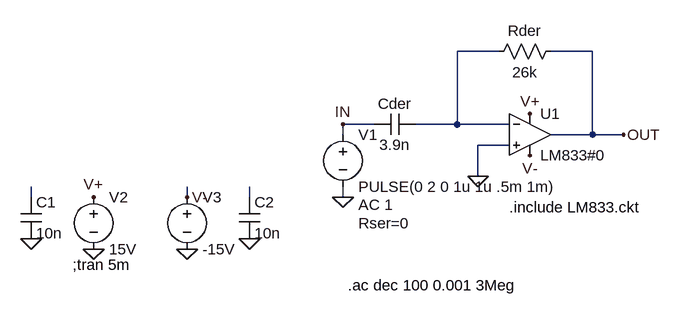
[diagram p0: schematic Derivador no compensado.asc]
Derivador no compensado.asc, the LTspice schematic file:
Version 4
SHEET 1 880 680
WIRE 208 64 144 64
WIRE 352 64 288 64
WIRE 16 176 -32 176
WIRE 144 176 144 64
WIRE 144 176 80 176
WIRE 224 176 144 176
WIRE -32 192 -32 176
WIRE 352 192 352 64
WIRE 352 192 288 192
WIRE 400 192 352 192
WIRE 224 208 176 208
WIRE 176 256 176 208
WIRE -512 288 -512 272
WIRE -272 288 -272 272
WIRE -176 288 -176 272
WIRE -32 288 -32 272
FLAG 176 256 0
FLAG -32 288 0
FLAG -272 368 0
FLAG -416 368 0
FLAG -416 288 V+
FLAG 256 160 V+
FLAG -272 288 V-
FLAG 256 224 V-
FLAG -512 352 0
FLAG -176 352 0
FLAG 400 192 OUT
FLAG -32 176 IN
SYMBOL Opamps\\opamp2 256 128 R0
SYMATTR InstName U1
SYMATTR Value LM833#0
SYMBOL cap 80 160 R90
WINDOW 0 0 32 VBottom 2
WINDOW 3 32 32 VTop 2
SYMATTR InstName Cder
SYMATTR Value 3.9n
SYMBOL voltage -32 176 R0
WINDOW 123 24 124 Left 2
WINDOW 39 24 152 Left 2
SYMATTR Value2 AC 1
SYMATTR SpiceLine Rser=0
SYMATTR InstName V1
SYMATTR Value PULSE(0 2 0 1u 1u .5m 1m)
SYMBOL res 304 48 R90
WINDOW 0 0 56 VBottom 2
WINDOW 3 32 56 VTop 2
SYMATTR InstName Rder
SYMATTR Value 26k
SYMBOL voltage -416 272 R0
WINDOW 123 0 0 Left 0
WINDOW 39 0 0 Left 0
SYMATTR InstName V2
SYMATTR Value 15V
SYMBOL voltage -272 272 R0
WINDOW 123 0 0 Left 0
WINDOW 39 0 0 Left 0
SYMATTR InstName V3
SYMATTR Value -15V
SYMBOL cap -528 288 R0
SYMATTR InstName C1
SYMATTR Value 10n
SYMBOL cap -192 288 R0
SYMATTR InstName C2
SYMATTR Value 10n
TEXT 224 304 Left 2 !.include LM833.ckt
TEXT -448 392 Left 2 !;tran 5m
TEXT -24 424 Left 2 !.ac dec 100 0.001 3Meg

The netlist it stands for:
* Derivador no compensado.asc
XU1 0 N001 V+ V- OUT LM833#0  ; pins In+ In- V+ V- OUT
Cder N001 IN 3.9n
V1 IN 0 PULSE(0 2 0 1u 1u .5m 1m) AC 1 Rser=0
Rder OUT N001 26k
V2 V+ 0 15V
V3 V- 0 -15V
C1 N002 0 10n
C2 N003 0 10n
.include LM833.ckt
;tran 5m
.ac dec 100 0.001 3Meg
.backanno
.end